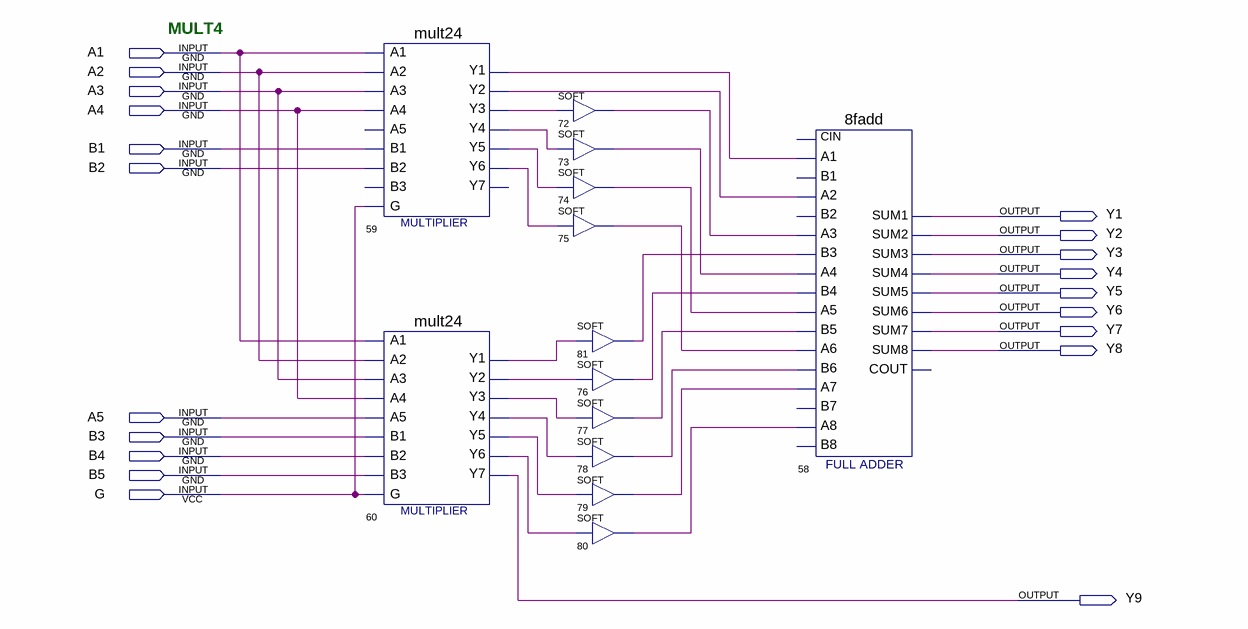
[diagram p0: schematic sheet]
// Quartus schematic mult4b.bdf as structural Verilog: 13 symbols, 20 pins
module mult4b (
  input  A1,
  input  A2,
  input  A3,
  input  A4,
  input  B1,
  input  B2,
  input  A5,
  input  B3,
  input  B4,
  input  B5,
  input  G,
  output Y1,
  output Y2,
  output Y3,
  output Y4,
  output Y5,
  output Y6,
  output Y7,
  output Y8,
  output Y9
);

  wire n59_y1, n59_y2, n59_y3, n59_y4, n59_y5, n59_y6, n60_y1, n60_y2, n60_y3, n60_y4, n60_y5, n60_y6,
       n72_out, n73_out, n74_out, n75_out, n76_out, n77_out, n78_out, n79_out, n80_out, n81_out;

  mult24 u_59 (
    .A1(A1), .A2(A2), .A3(A3), .A4(A4), .B1(B1), .B2(B2), .G(G), .Y6(n59_y6), .Y5(n59_y5), .Y4(n59_y4),
    .Y3(n59_y3), .Y2(n59_y2), .Y1(n59_y1));  // open: A5, B3, Y7
  mult24 u_60 (
    .A1(A1), .A2(A2), .A3(A3), .A4(A4), .A5(A5), .B1(B3), .B2(B4), .B3(B5), .G(G), .Y7(Y9), .Y6(n60_y6),
    .Y5(n60_y5), .Y4(n60_y4), .Y3(n60_y3), .Y2(n60_y2), .Y1(n60_y1));
  SOFT u_72 (.IN(n59_y3), .OUT(n72_out));
  SOFT u_73 (.IN(n59_y4), .OUT(n73_out));
  SOFT u_74 (.IN(n59_y5), .OUT(n74_out));
  SOFT u_75 (.IN(n59_y6), .OUT(n75_out));
  SOFT u_81 (.IN(n60_y1), .OUT(n81_out));
  SOFT u_76 (.IN(n60_y2), .OUT(n76_out));
  SOFT u_77 (.IN(n60_y3), .OUT(n77_out));
  SOFT u_78 (.IN(n60_y4), .OUT(n78_out));
  SOFT u_79 (.IN(n60_y5), .OUT(n79_out));
  SOFT u_80 (.IN(n60_y6), .OUT(n80_out));
  \8fadd  u_58 (
    .A1(n59_y1), .A3(n72_out), .A2(n59_y2), .A5(n74_out), .B4(n76_out), .A4(n73_out), .B3(n81_out),
    .A7(n79_out), .B6(n78_out), .A6(n75_out), .B5(n77_out), .A8(n80_out), .SUM2(Y2), .SUM1(Y1), .SUM6(Y6),
    .SUM5(Y5), .SUM4(Y4), .SUM3(Y3), .SUM8(Y8), .SUM7(Y7));  // open: CIN, B2, B1, B8, B7, COUT

  // Notes on the sheet:
  //   MULT4
endmodule
